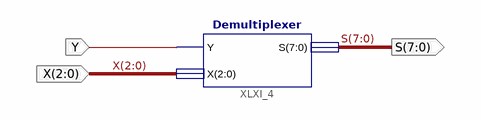
[diagram p0: schematic sheet 1]
// Xilinx ISE schematic scheme.sch (spartan6) as structural Verilog: 1 symbols, 3 ports
module scheme (
  input  Y,
  input  [2:0] X,
  output [7:0] S
);

  Demultiplexer XLXI_4 (.Y(Y), .X(X), .S(S));
endmodule
